# Altium project Demo.PrjPCB
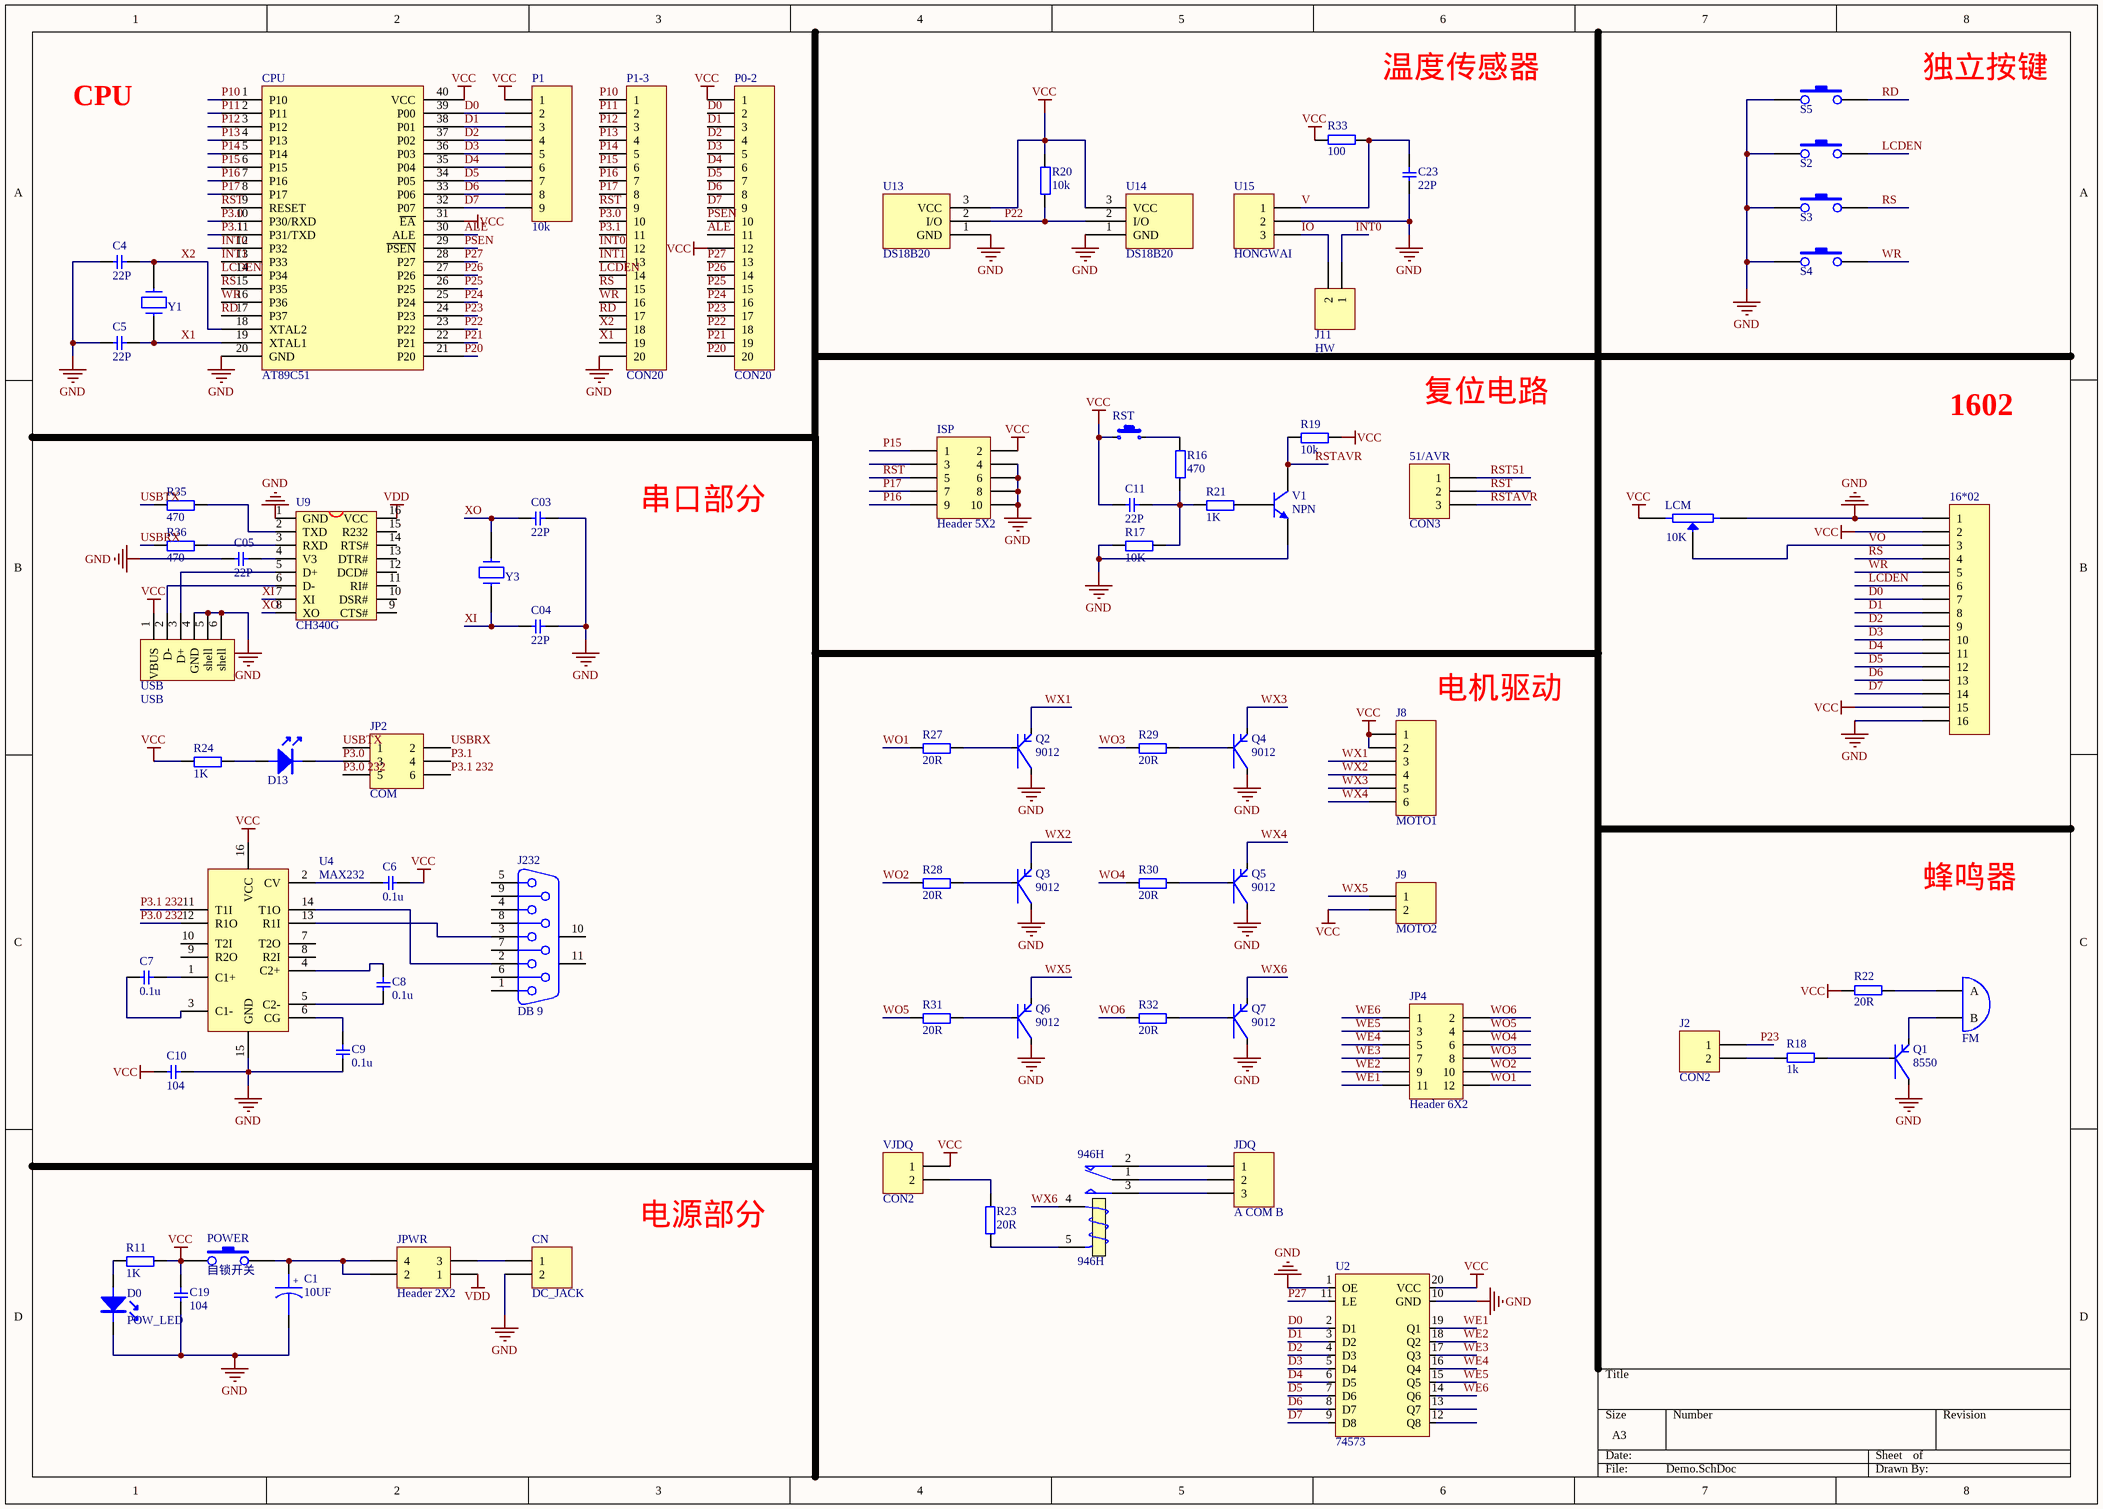
[diagram p0: Demo.SchDoc]
1 sheet, 79 parts. Net scope: global (net labels, ports and power ports of the same name join across sheets).
Board file: D.PcbDoc

## Sheet Demo.SchDoc
size A3

### Parts
16*02  Header 16  [HDR1X16]  (value not drawn)
51/AVR  CON3  [HDR1X3]
946H  946H  [MODULE5B]
C1  CAPD  [RB470U]  (value not drawn)
C03  22  [0805C]  (value not drawn)
C4  22  [0805C]  (value not drawn)
C04  22  [0805C]  (value not drawn)
C5  22  [0805C]  (value not drawn)
C05  104  [0805C]  (value not drawn)
C6  (no value)  [0805C]
C7  (no value)  [0805C]
C8  (no value)  [0805C]
C9  (no value)  [0805C]
C10  (no value)  [0805C]
C11  104  [0805C]  (value not drawn)
C19  (no value)  [0805C]
C23  104  [0805C]  (value not drawn)
CN  DC_JACK  [HDR1X2]
CPU  AT89C51  [DIP40紧锁座]
D0  POW_LED  [0805-LED]
D13  LED  [0805-LED]  (value not drawn)
FM  BELL  [BELL]  (value not drawn)
ISP  Header 5X2  [HDR2X5]
J2  CON2  [HDR1X2]
J8  MOTO1  [HDR1X6]
J9  MOTO2  [HDR1X2]
J11  HW  [HDR1X2]
J232  DB 9  [DSUB1.385-2H9]
JDQ  A COM B  [HDR1X3]
JP2  COM  [HDR2X3]
JP4  Header 6X2  [HDR2X6]
JPWR  Header 2X2  [HDR2X2]
LCM  滑动变阻器  [滑动变阻器]  (value not drawn)
P0-2  CON20  [HDR1X20]
P1  10k  [HDR1X9]
P1-3  CON20  [HDR1X20]
POWER  自锁开关  [自锁开关]
Q1  8550  [SOT-23]
Q2  9012  [SOT-23]
Q3  9012  [SOT-23]
Q4  9012  [SOT-23]
Q5  9012  [SOT-23]
Q6  9012  [SOT-23]
Q7  9012  [SOT-23]
R11  1K  [0805]
R16  470  [0805]
R17  10K  [0805]
R18  1k  [0805]
R19  10k  [0805]
R20  10k  [0805]
R21  1K  [0805]
R22  20R  [0805]
R23  20R  [0805]
R24  1K  [0805]
R27  20R  [0805]
R28  20R  [0805]
R29  20R  [0805]
R30  20R  [0805]
R31  20R  [0805]
R32  20R  [0805]
R33  100  [0805]
R35  470  [0805]
R36  470  [0805]
RST  SW  [SWD]  (value not drawn)
S2  Sa  [拨动开关]  (value not drawn)
S3  Sa  [拨动开关]  (value not drawn)
S4  Sa  [拨动开关]  (value not drawn)
S5  Sa  [拨动开关]  (value not drawn)
U2  74573  [SO20W]
U4  MAX232  [SO-16]
U9  CH340G  [SO-16]
U13  DS18B20  [DS18B20]
U14  DS18B20  [DS18B20]
U15  HONGWAI  [HDR1X3]
USB  USB  [USB-B]
V1  NPN  [TO-226-AA]
VJDQ  CON2  [HDR1X2]
Y1  CRYSTAL  [XTAL]  (value not drawn)
Y3  12MHZ  [XTAL]  (value not drawn)

### Nets
GND: 16*02.1 16*02.16 C1.2 C03.2 C4.1 C04.2 C5.1 C05.1 C9.1 C10.2 C19.1 C23.1 CN.2 CPU.20(GND) D0.2 ISP.4 ISP.6 ISP.8 ISP.10 LCM.1 P1-3.20 Q1.3 Q2.3 Q3.3 Q4.3 Q5.3 Q6.3 Q7.3 R17.1 S2.1 S3.1 S4.1 S5.1 U2.1(OE) U2.10(GND) U4.15(GND) U9.1(GND) U13.1(GND) U14.1(GND) U15.2 USB.4(GND) USB.5(shell) USB.6(shell) V1.3(E)
VCC: 16*02.2 16*02.15 C6.1 C10.1 C11.1 C19.2 CPU.31(~{EA}) CPU.40(VCC) ISP.2 J8.1 J8.2 J9.2 LCM.2 P0-2.1 P0-2.12 P1.1 POWER.3 R11.2 R19.2 R20.2 R22.2 R24.1 R33.2 RST.1 U2.20(VCC) U4.16(VCC) U13.3(VCC) U14.3(VCC) USB.1(VBUS) VJDQ.1
VDD: JPWR.1 U9.16(VCC)
ALE: CPU.30(ALE) P0-2.11
D0: 16*02.7 CPU.39(P00) P0-2.2 P1.2 U2.2(D1)
D1: 16*02.8 CPU.38(P01) P0-2.3 P1.3 U2.3(D2)
D2: 16*02.9 CPU.37(P02) P0-2.4 P1.4 U2.4(D3)
D3: 16*02.10 CPU.36(P03) P0-2.5 P1.5 U2.5(D4)
D4: 16*02.11 CPU.35(P04) P0-2.6 P1.6 U2.6(D5)
D5: 16*02.12 CPU.34(P05) P0-2.7 P1.7 U2.7(D6)
D6: 16*02.13 CPU.33(P06) P0-2.8 P1.8 U2.8(D7)
D7: 16*02.14 CPU.32(P07) P0-2.9 P1.9 U2.9(D8)
INT0: CPU.12(P32) J11.1 P1-3.12
INT1: CPU.13(P33) P1-3.13
IO: J11.2 U15.3
LCDEN: 16*02.6 CPU.14(P34) P1-3.14 S2.2
P3.0: CPU.10(P30/RXD) D13.2 JP2.3 P1-3.10
P3.0 232: JP2.5 U4.12(R1O)
P3.1: CPU.11(P31/TXD) JP2.4 P1-3.11
P3.1 232: JP2.6 U4.11(T1I)
P10: CPU.1(P10) P1-3.1
P11: CPU.2(P11) P1-3.2
P12: CPU.3(P12) P1-3.3
P13: CPU.4(P13) P1-3.4
P14: CPU.5(P14) P1-3.5
P15: CPU.6(P15) ISP.1 P1-3.6
P16: CPU.7(P16) ISP.9 P1-3.7
P17: CPU.8(P17) ISP.7 P1-3.8
P20: CPU.21(P20) P0-2.20
P21: CPU.22(P21) P0-2.19
P22: CPU.23(P22) P0-2.18 R20.1 U13.2(I/O) U14.2(I/O)
P23: CPU.24(P23) J2.1 P0-2.17
P24: CPU.25(P24) P0-2.16
P25: CPU.26(P25) P0-2.15
P26: CPU.27(P26) P0-2.14
P27: CPU.28(P27) P0-2.13 U2.11(LE)
PSEN: CPU.29(~{PSEN}) P0-2.10
RD: CPU.17(P37) P1-3.17 S5.2
RS: 16*02.4 CPU.15(P35) P1-3.15 S3.2
RST: 51/AVR.2 CPU.9(RESET) ISP.5 P1-3.9
RST51: 51/AVR.1
RSTAVR: 51/AVR.3 R19.1 V1.1(C)
USBRX: JP2.2 R36.1
USBTX: JP2.1 R35.1
V: C23.2 R33.1 U15.1
VO: 16*02.3 LCM.3(W)
WE1: JP4.11 U2.19(Q1)
WE2: JP4.9 U2.18(Q2)
WE3: JP4.7 U2.17(Q3)
WE4: JP4.5 U2.16(Q4)
WE5: JP4.3 U2.15(Q5)
WE6: JP4.1 U2.14(Q6)
WO1: JP4.12 R27.1
WO2: JP4.10 R28.1
WO3: JP4.8 R29.1
WO4: JP4.6 R30.1
WO5: JP4.4 R31.1
WO6: JP4.2 R32.1
WR: 16*02.5 CPU.16(P36) P1-3.16 S4.2
WX1: J8.3 Q2.2
WX2: J8.4 Q3.2
WX3: J8.5 Q4.2
WX4: J8.6 Q5.2
WX5: J9.1 Q6.2
WX6: 946H.4(T1) Q7.2
X1: C5.2 CPU.19(XTAL1) P1-3.19 Y1.1
X2: C4.2 CPU.18(XTAL2) P1-3.18 Y1.2
XI: C04.1 U9.7(XI) Y3.1
XO: C03.1 U9.8(XO) Y3.2
Net946H_1: 946H.1(COM) JDQ.2
Net946H_2: 946H.2(NC) JDQ.1
Net946H_3: 946H.3(NO) JDQ.3
Net946H_5: 946H.5(T2) R23.2
NetC1_1: C1.1 JPWR.2 JPWR.4 POWER.5
NetC05_2: C05.2 U9.4(V3)
NetC6_2: C6.2 U4.2(CV)
NetC7_1: C7.1 U4.3(C1-)
NetC7_2: C7.2 U4.1(C1+)
NetC8_1: C8.1 U4.5(C2-)
NetC8_2: C8.2 U4.4(C2+)
NetC9_2: C9.2 U4.6(CG)
NetC11_2: C11.2 R16.1 R17.2 R21.1
NetCN_1: CN.1 JPWR.3
NetD0_1: D0.1 R11.1
NetD13_1: D13.1 R24.2
NetFM_1: FM.1(A) R22.1
NetFM_2: FM.2(B) Q1.2
NetJ2_2: J2.2 R18.2
NetJ232_2: J232.2 U4.14(T1O)
NetJ232_3: J232.3 U4.13(R1I)
NetQ1_1: Q1.1 R18.1
NetQ2_1: Q2.1 R27.2
NetQ3_1: Q3.1 R28.2
NetQ4_1: Q4.1 R29.2
NetQ5_1: Q5.1 R30.2
NetQ6_1: Q6.1 R31.2
NetQ7_1: Q7.1 R32.2
NetR16_2: R16.2 RST.2
NetR21_2: R21.2 V1.2(B)
NetR23_1: R23.1 VJDQ.2
NetR35_2: R35.2 U9.2(TXD)
NetR36_2: R36.2 U9.3(RXD)
NetU9_5: U9.5(D+) USB.3(D+)
NetU9_6: U9.6(D-) USB.2(D-)

Not connected (* = marked no-connect by the designer): ISP 3; J232 1 4 5 6 7 8 9 10(MH1) 11(MH2); U2 12(Q8) 13(Q7); U4 7(T2O) 8(R2I) 9(R2O) 10(T2I); U9 9(CTS#) 10(DSR#) 11(RI#) 12(DCD#) 13(DTR#) 14(RTS#) 15(R232)

### Notes on the sheet
- CPU
- 温度传感器
- 独立按键
- 复位电路
- 1602
- 串口部分
- (near J8) 电机驱动
- 蜂鸣器
- 电源部分
- (in symbol CAP) 22P; 0.1u; 104
- (in symbol CAPD) +; 10UF
- (in symbol 滑动变阻器) 10K

### Library data of the parts
16*02 = Header 16: Header, 16-Pin; LatestRevisionDate: 17-Jul-2002; LatestRevisionNote: Re-released for DXP Platform.; Publisher: Altium Limited
51/AVR JDQ U15 = Header 3: Header, 3-Pin; LatestRevisionDate: 17-Jul-2002; LatestRevisionNote: Re-released for DXP Platform.; Publisher: Altium Limited
946H = Relay: SPDT Relay; Published: 8-Jun-2000; LatestRevisionDate: 17-Jul-2002; LatestRevisionNote: Re-released for DXP Platform.; PackageReference: MODULE5B; Publisher: Altium Limited
C03 C4 C04 C5 C05-C11 C19 C23 = CAP: C
CN J2 J9 J11 VJDQ = Header 2: Header, 2-Pin; LatestRevisionDate: 17-Jul-2002; LatestRevisionNote: Re-released for DXP Platform.; Publisher: Altium Limited
D0 = LED
ISP = Header 5X2: Header, 5-Pin, Dual row; LatestRevisionDate: 17-Jul-2002; LatestRevisionNote: Re-released for DXP Platform.; Publisher: Altium Limited
J8 = Header 6: Header, 6-Pin; LatestRevisionDate: 17-Jul-2002; LatestRevisionNote: Re-released for DXP Platform.; Publisher: Altium Limited
J232 = D Connector 9: Receptacle Assembly, 9 Position, Right Angle; PackageDocument: O; Positions: 9; Published: 15-Jun-2001; LatestRevisionDate: 17-Jul-2002; LatestRevisionNote: Re-released for DXP Platform.; DatasheetDocument: 1-Sep-1999; PackageReference: 788750; Publisher: Altium Limited; Orientation: Right Angle; Gender: Receptacle
JP2 = Header 3X2H: Header, 3-Pin, Dual row, Right Angle; LatestRevisionDate: 17-Jul-2002; LatestRevisionNote: Re-released for DXP Platform.; Publisher: Altium Limited
JP4 = Header 6X2: Header, 6-Pin, Dual row; LatestRevisionDate: 17-Jul-2002; LatestRevisionNote: Re-released for DXP Platform.; Publisher: Altium Limited
JPWR = Header 2X2: Header, 2-Pin, Dual row; LatestRevisionDate: 17-Jul-2002; LatestRevisionNote: Re-released for DXP Platform.; Publisher: Altium Limited
P0-2 P1-3 = Header 20: Header, 20-Pin; LatestRevisionDate: 17-Jul-2002; LatestRevisionNote: Re-released for DXP Platform.; Publisher: Altium Limited
P1 = Header 9: Header, 9-Pin; LatestRevisionDate: 17-Jul-2002; LatestRevisionNote: Re-released for DXP Platform.; Publisher: Altium Limited
Q1-Q7 = PNP
R11 R16-R24 R27-R33 R35 R36 = R1: R?
S2-S5 = SW2
U9 = CH340G: USB2UART
V1 = NPN: NPN Bipolar Transistor; Published: 8-Jun-2000; LatestRevisionDate: 17-Jul-2002; LatestRevisionNote: Re-released for DXP Platform.; PackageReference: TO-226-AA; Publisher: Altium Limited; PackageDescription: TO, Flat Index; 3 In-Line, Axial Leads; Body Dia. 4.8mm; Leads 0.55 x 0.51 mm (max); Code_JEDEC: TO-226-AA
Y3 = CRYSTAL